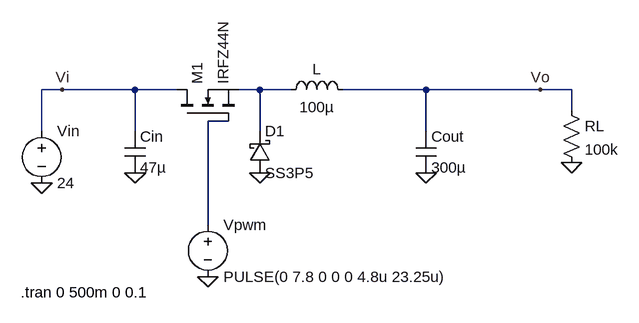
[diagram p0: schematic Buck conv final.asc]
Buck conv final.asc, the LTspice schematic file:
Version 4
SHEET 1 1160 680
WIRE -64 80 -96 80
WIRE 48 80 -64 80
WIRE 112 80 48 80
WIRE 240 80 208 80
WIRE 288 80 240 80
WIRE 496 80 368 80
WIRE 672 80 496 80
WIRE 720 80 672 80
WIRE 720 112 720 80
WIRE 192 128 160 128
WIRE -96 144 -96 80
WIRE 48 144 48 80
WIRE 240 144 240 80
WIRE 496 144 496 80
WIRE 160 288 160 128
FLAG 48 208 0
FLAG -96 224 0
FLAG 160 368 0
FLAG 240 208 0
FLAG 496 208 0
FLAG 720 192 0
FLAG 672 80 Vo
FLAG -64 80 Vi
SYMBOL cap 32 144 R0
SYMATTR InstName Cin
SYMATTR Value 47µ
SYMBOL cap 480 144 R0
SYMATTR InstName Cout
SYMATTR Value 300µ
SYMBOL schottky 224 208 M180
WINDOW 0 24 64 Left 2
WINDOW 3 24 0 Left 2
SYMATTR InstName D1
SYMATTR Value SS3P5
SYMATTR Description Diode
SYMATTR Type diode
SYMBOL nmos 112 128 R270
SYMATTR InstName M1
SYMATTR Value IRFZ44N
SYMBOL ind 272 96 R270
WINDOW 0 32 56 VTop 2
WINDOW 3 5 56 VBottom 2
SYMATTR InstName L
SYMATTR Value 100µ
SYMBOL voltage 160 272 R0
WINDOW 123 0 0 Left 0
WINDOW 39 0 0 Left 0
SYMATTR InstName Vpwm
SYMATTR Value PULSE(0 7.8 0 0 0 4.8u 23.25u)
SYMBOL voltage -96 128 R0
WINDOW 123 0 0 Left 0
WINDOW 39 0 0 Left 0
SYMATTR InstName Vin
SYMATTR Value 24
SYMBOL res 704 96 R0
SYMATTR InstName RL
SYMATTR Value 100k
TEXT -128 392 Left 2 !.tran 0 500m 0 0.1

The netlist it stands for:
* Buck conv final.asc
Cin Vi 0 47µ
Cout Vo 0 300µ
D1 0 N001 SS3P5
M1 Vi N002 N001 N001 IRFZ44N
L N001 Vo 100µ
Vpwm N002 0 PULSE(0 7.8 0 0 0 4.8u 23.25u)
Vin Vi 0 24
RL Vo 0 100k
.model D D
.lib standard.dio
.model NMOS NMOS
.model PMOS PMOS
.lib standard.mos
.tran 0 500m 0 0.1
.backanno
.end